# EAGLE design rgb_chronos (EAGLE 8.4.1)
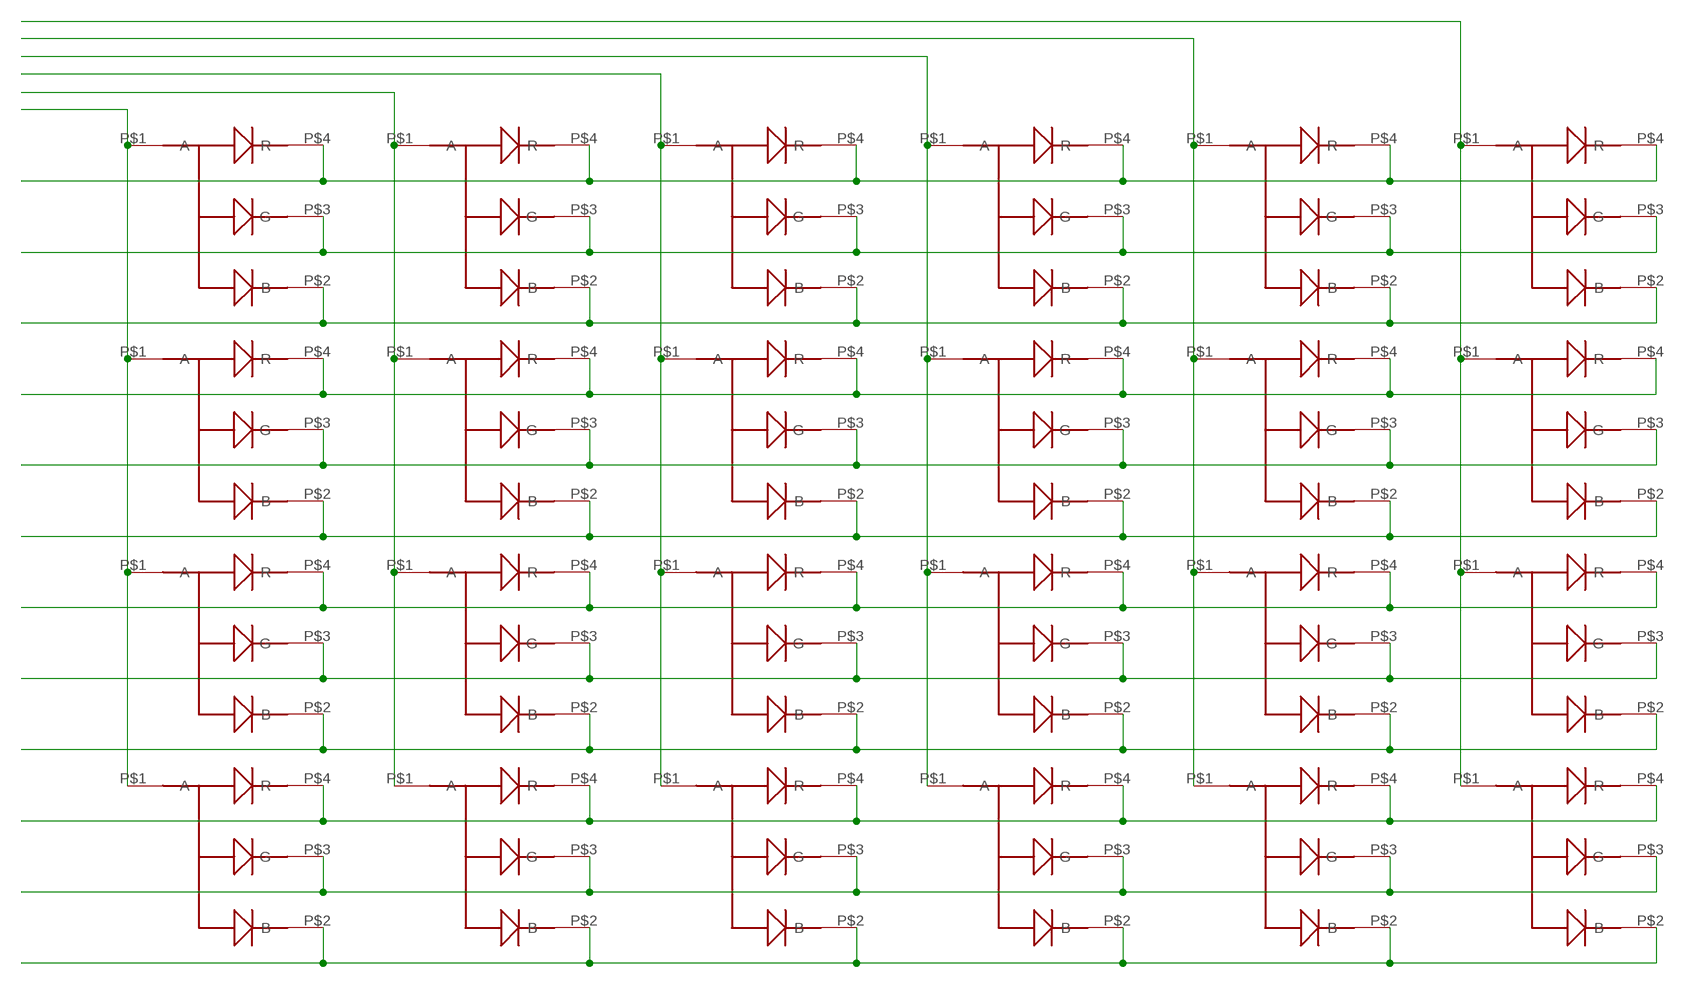
[diagram p0: schematic, sheet 1]

## Parts
U$1  ASMB-MTB0-0A3A2  LED3_ARGB  [PLCC4-LED]
U$2  ASMB-MTB0-0A3A2  LED3_ARGB  [PLCC4-LED]
U$3  ASMB-MTB0-0A3A2  LED3_ARGB  [PLCC4-LED]
U$4  ASMB-MTB0-0A3A2  LED3_ARGB  [PLCC4-LED]
U$5  ASMB-MTB0-0A3A2  LED3_ARGB  [PLCC4-LED]
U$6  ASMB-MTB0-0A3A2  LED3_ARGB  [PLCC4-LED]
U$7  ASMB-MTB0-0A3A2  LED3_ARGB  [PLCC4-LED]
U$8  ASMB-MTB0-0A3A2  LED3_ARGB  [PLCC4-LED]
U$9  ASMB-MTB0-0A3A2  LED3_ARGB  [PLCC4-LED]
U$10  ASMB-MTB0-0A3A2  LED3_ARGB  [PLCC4-LED]
U$11  ASMB-MTB0-0A3A2  LED3_ARGB  [PLCC4-LED]
U$12  ASMB-MTB0-0A3A2  LED3_ARGB  [PLCC4-LED]
U$13  ASMB-MTB0-0A3A2  LED3_ARGB  [PLCC4-LED]
U$14  ASMB-MTB0-0A3A2  LED3_ARGB  [PLCC4-LED]
U$15  ASMB-MTB0-0A3A2  LED3_ARGB  [PLCC4-LED]
U$16  ASMB-MTB0-0A3A2  LED3_ARGB  [PLCC4-LED]
U$17  ASMB-MTB0-0A3A2  LED3_ARGB  [PLCC4-LED]
U$18  ASMB-MTB0-0A3A2  LED3_ARGB  [PLCC4-LED]
U$19  ASMB-MTB0-0A3A2  LED3_ARGB  [PLCC4-LED]
U$20  ASMB-MTB0-0A3A2  LED3_ARGB  [PLCC4-LED]
U$21  ASMB-MTB0-0A3A2  LED3_ARGB  [PLCC4-LED]
U$22  ASMB-MTB0-0A3A2  LED3_ARGB  [PLCC4-LED]
U$23  ASMB-MTB0-0A3A2  LED3_ARGB  [PLCC4-LED]
U$24  ASMB-MTB0-0A3A2  LED3_ARGB  [PLCC4-LED]

## Nets
COL0: U$1.P$1(A) U$2.P$1(A) U$3.P$1(A) U$4.P$1(A)
COL1: U$5.P$1(A) U$6.P$1(A) U$7.P$1(A) U$8.P$1(A)
COL2: U$9.P$1(A) U$10.P$1(A) U$11.P$1(A) U$12.P$1(A)
COL3: U$13.P$1(A) U$14.P$1(A) U$15.P$1(A) U$16.P$1(A)
COL4: U$17.P$1(A) U$18.P$1(A) U$19.P$1(A) U$20.P$1(A)
COL5: U$21.P$1(A) U$22.P$1(A) U$23.P$1(A) U$24.P$1(A)
ROW0_B: U$1.P$2(B) U$5.P$2(B) U$9.P$2(B) U$13.P$2(B) U$17.P$2(B) U$21.P$2(B)
ROW0_G: U$1.P$3(G) U$5.P$3(G) U$9.P$3(G) U$13.P$3(G) U$17.P$3(G) U$21.P$3(G)
ROW0_R: U$1.P$4(R) U$5.P$4(R) U$9.P$4(R) U$13.P$4(R) U$17.P$4(R) U$21.P$4(R)
ROW1_B: U$2.P$2(B) U$6.P$2(B) U$10.P$2(B) U$14.P$2(B) U$18.P$2(B) U$22.P$2(B)
ROW1_G: U$2.P$3(G) U$6.P$3(G) U$10.P$3(G) U$14.P$3(G) U$18.P$3(G) U$22.P$3(G)
ROW1_R: U$2.P$4(R) U$6.P$4(R) U$10.P$4(R) U$14.P$4(R) U$18.P$4(R) U$22.P$4(R)
ROW2_B: U$3.P$2(B) U$7.P$2(B) U$11.P$2(B) U$15.P$2(B) U$19.P$2(B) U$23.P$2(B)
ROW2_G: U$3.P$3(G) U$7.P$3(G) U$11.P$3(G) U$15.P$3(G) U$19.P$3(G) U$23.P$3(G)
ROW2_R: U$3.P$4(R) U$7.P$4(R) U$11.P$4(R) U$15.P$4(R) U$19.P$4(R) U$23.P$4(R)
ROW3_B: U$4.P$2(B) U$8.P$2(B) U$12.P$2(B) U$16.P$2(B) U$20.P$2(B) U$24.P$2(B)
ROW3_G: U$4.P$3(G) U$8.P$3(G) U$12.P$3(G) U$16.P$3(G) U$20.P$3(G) U$24.P$3(G)
ROW3_R: U$4.P$4(R) U$8.P$4(R) U$12.P$4(R) U$16.P$4(R) U$20.P$4(R) U$24.P$4(R)

## Library data of the parts
U$1-U$24 = pmg-library:LED3_ARGB

## Board
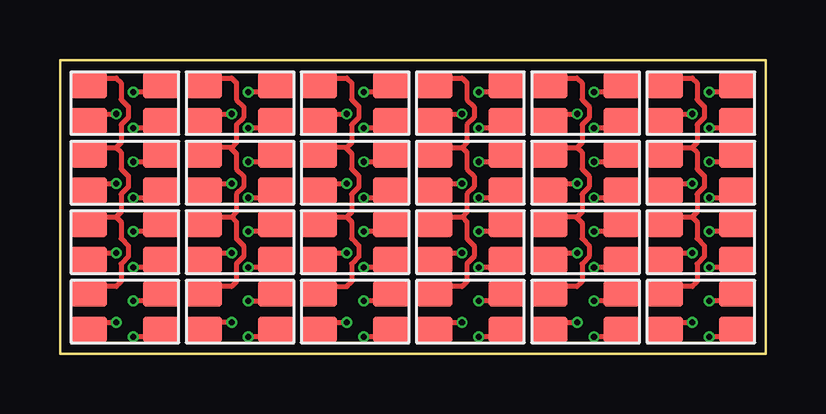
[diagram p1: board, top side]
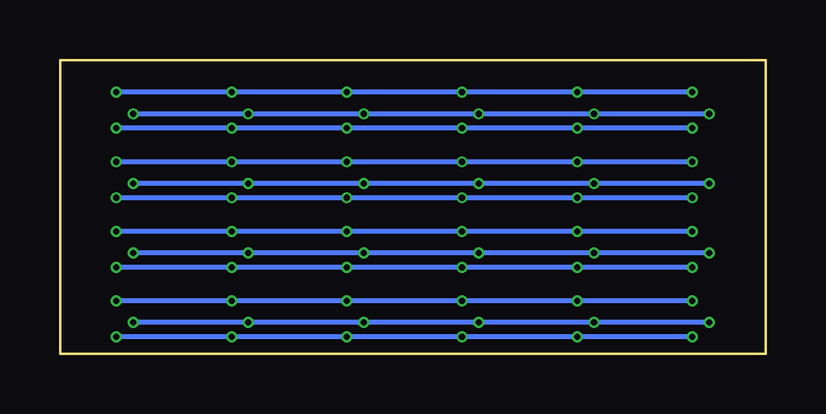
[diagram p2: board, bottom side, seen from below]

Size 29.4 x 12.25 mm. Coordinates in mm from the lower left corner, seen from the top.
Outline: 0,0 29.4,0 29.4,12.25 0,12.25 0,0
Copper layers (1*2*15*16): Top 0.035559375mm / dielectric 0.17018125mm / Route2 0.01778125mm / dielectric 47mil / Route15 0.01778125mm / dielectric 0.17018125mm / Bottom 0.035559375mm
Design rules "OSHPark-4layer *": minimum track width 5mil, minimum drill 10mil, track to track 5mil, track to pad 5mil, pad to pad 5mil, via to via 5mil, smd to smd 5mil, copper to edge 15mil, drill to drill 6mil, minimum pad ring 4mil, minimum via ring 4mil, stop-mask expansion 2.5mil, vias tented up to drill 0mil, thermal gap 10mil

### Footprints (pad centres in the part's own frame; a part is rotated, then mirrored left to right if it is on the bottom)
PLCC4-LED = smd 1.5 x 1.1: P$1 -1.5,0.75; P$2 1.5,0.75; P$3 1.5,-0.75; P$4 -1.5,-0.75

### Placement (x,y rotation side)
U$1  26.7,1.75 0 top
U$2  26.7,4.65 0 top
U$3  26.7,7.55 0 top
U$4  26.7,10.45 0 top
U$5  21.9,1.75 0 top
U$6  21.9,4.65 0 top
U$7  21.9,7.55 0 top
U$8  21.9,10.45 0 top
U$9  17.1,1.75 0 top
U$10  17.1,4.65 0 top
U$11  17.1,7.55 0 top
U$12  17.1,10.45 0 top
U$13  12.3,1.75 0 top
U$14  12.3,4.65 0 top
U$15  12.3,7.55 0 top
U$16  12.3,10.45 0 top
U$17  7.5,1.75 0 top
U$18  7.5,4.65 0 top
U$19  7.5,7.55 0 top
U$20  7.5,10.45 0 top
U$21  2.7,1.75 0 top
U$22  2.7,4.65 0 top
U$23  2.7,7.55 0 top
U$24  2.7,10.45 0 top

### Tracks (layer width: path | path; a pad name or v marks a point on that pad's centre or on a via)
COL0
  Top 0.2: U$4.P$1 25.5,11.5 26.35,11.5 26.55,11.3 26.55,10.6 26.85,10.3 26.85,9.85 26.55,9.55 26.55,8.8 26.35,8.6 | U$3.P$1 25.5,8.6 26.35,8.6 | U$2.P$1 25.5,5.7 26.35,5.7 | U$1.P$1 25.5,2.8 26.35,2.8 26.55,3 26.55,3.75 26.85,4.05 26.85,4.5 26.55,4.8 26.55,5.5 26.35,5.7 | 26.35,8.6 26.55,8.4 26.55,7.7 26.85,7.4 26.85,6.95 26.55,6.65 26.55,5.9 26.35,5.7
COL1
  Top 0.2: U$8.P$1 20.7,11.5 21.55,11.5 21.75,11.3 21.75,10.6 22.05,10.3 22.05,9.85 21.75,9.55 21.75,8.8 21.55,8.6 | U$7.P$1 20.7,8.6 21.55,8.6 | U$6.P$1 20.7,5.7 21.5,5.7 | 21.5,5.7 21.55,5.7 21.75,5.9 21.75,6.65 22.05,6.95 22.05,7.4 21.75,7.7 21.75,8.4 21.55,8.6 | U$5.P$1 20.7,2.8 21.55,2.8 21.75,3 21.75,3.75 22.05,4.05 22.05,4.5 21.75,4.8 21.75,5.45 21.5,5.7
COL2
  Top 0.2: U$12.P$1 15.9,11.5 16.75,11.5 16.95,11.3 16.95,10.6 17.25,10.3 17.25,9.85 16.95,9.55 16.95,8.8 16.75,8.6 | U$11.P$1 15.9,8.6 16.75,8.6 | U$10.P$1 15.9,5.7 16.75,5.7 | U$9.P$1 15.9,2.8 16.75,2.8 16.95,3 16.95,3.75 17.25,4.05 17.25,4.5 16.95,4.8 16.95,5.5 16.75,5.7 | 16.75,8.6 16.95,8.4 16.95,7.7 17.25,7.4 17.25,6.95 16.95,6.65 16.95,5.9 16.75,5.7
COL3
  Top 0.2: U$16.P$1 11.1,11.5 11.95,11.5 12.15,11.3 12.15,10.6 12.45,10.3 12.45,9.85 12.15,9.55 12.15,8.8 11.95,8.6 11.9,8.6 | U$15.P$1 11.1,8.6 11.9,8.6 | U$14.P$1 11.1,5.7 11.95,5.7 | U$13.P$1 11.1,2.8 11.95,2.8 12.15,3 12.15,3.75 12.45,4.05 12.45,4.5 12.15,4.8 12.15,5.5 11.95,5.7 | 11.9,8.6 12.15,8.35 12.15,7.7 12.45,7.4 12.45,6.95 12.15,6.65 12.15,5.9 11.95,5.7
COL4
  Top 0.2: U$20.P$1 6.3,11.5 7.15,11.5 7.35,11.3 7.35,10.6 7.65,10.3 7.65,9.85 7.35,9.55 7.35,8.8 7.15,8.6 7.1,8.6 | U$19.P$1 6.3,8.6 7.1,8.6 | U$18.P$1 6.3,5.7 7.15,5.7 | U$17.P$1 6.3,2.8 7.15,2.8 7.35,3 7.35,3.75 7.65,4.05 7.65,4.5 7.35,4.8 7.35,5.5 7.15,5.7 | 7.1,8.6 7.35,8.35 7.35,7.7 7.65,7.4 7.65,6.95 7.35,6.65 7.35,5.9 7.15,5.7
COL5
  Top 0.2: U$24.P$1 1.5,11.5 2.35,11.5 2.55,11.3 2.55,10.6 2.85,10.3 2.85,9.85 2.55,9.55 2.55,8.8 2.35,8.6 | U$23.P$1 1.5,8.6 2.35,8.6 | U$22.P$1 1.5,5.7 2.35,5.7 | U$21.P$1 1.5,2.8 2.35,2.8 2.55,3 2.55,3.75 2.85,4.05 2.85,4.5 2.55,4.8 2.55,5.5 2.35,5.7 | 2.35,8.6 2.55,8.4 2.55,7.7 2.85,7.4 2.85,6.95 2.55,6.65 2.55,5.9 2.35,5.7
ROW0_B  (via drill 0.25)
  Top 0.2: U$21.P$2 3.9,2.2 v3.05,2.2 | U$17.P$2 8.7,2.2 v7.85,2.2 | U$13.P$2 13.5,2.2 v12.65,2.2 | U$9.P$2 18.3,2.2 v17.45,2.2 | U$5.P$2 23.1,2.2 v22.25,2.2 | U$1.P$2 27.9,2.2 v27.05,2.2
  Bottom 0.2: v3.05,2.2 v7.85,2.2 v12.65,2.2 v17.45,2.2 v22.25,2.2 v27.05,2.2
ROW0_G  (via drill 0.25)
  Top 0.2: U$21.P$3 3.9,0.7 v3.05,0.7 | U$17.P$3 8.7,0.7 v7.85,0.7 | U$13.P$3 13.5,0.7 v12.65,0.7 | U$9.P$3 18.3,0.7 v17.45,0.7 | U$5.P$3 23.1,0.7 v22.25,0.7 | U$1.P$3 27.9,0.7 v27.05,0.7
  Bottom 0.2: v3.05,0.7 v7.85,0.7 v12.65,0.7 v17.45,0.7 v22.25,0.7 v27.05,0.7
ROW0_R  (via drill 0.25)
  Top 0.2: U$21.P$4 1.5,1.3 v2.35,1.3 | U$17.P$4 6.3,1.3 v7.15,1.3 | U$13.P$4 11.1,1.3 v11.95,1.3 | U$9.P$4 15.9,1.3 v16.75,1.3 | U$5.P$4 20.7,1.3 v21.55,1.3 | U$1.P$4 25.5,1.3 v26.35,1.3
  Bottom 0.2: v2.35,1.3 v7.15,1.3 v11.95,1.3 v16.75,1.3 v21.55,1.3 v26.35,1.3
ROW1_B  (via drill 0.25)
  Top 0.2: U$22.P$2 3.9,5.1 v3.05,5.1 | U$18.P$2 8.7,5.1 v7.85,5.1 | U$14.P$2 13.5,5.1 v12.65,5.1 | U$10.P$2 18.3,5.1 v17.45,5.1 | U$6.P$2 23.1,5.1 v22.25,5.1 | U$2.P$2 27.9,5.1 v27.05,5.1
  Bottom 0.2: v3.05,5.1 v7.85,5.1 v12.65,5.1 v17.45,5.1 v22.25,5.1 v27.05,5.1
ROW1_G  (via drill 0.25)
  Top 0.2: U$22.P$3 3.9,3.6 v3.05,3.6 | U$18.P$3 8.7,3.6 v7.85,3.6 | U$14.P$3 13.5,3.6 v12.65,3.6 | U$10.P$3 18.3,3.6 v17.45,3.6 | U$6.P$3 23.1,3.6 v22.25,3.6 | U$2.P$3 27.9,3.6 v27.05,3.6
  Bottom 0.2: v3.05,3.6 v7.85,3.6 v12.65,3.6 v17.45,3.6 v22.25,3.6 v27.05,3.6
ROW1_R  (via drill 0.25)
  Top 0.2: U$22.P$4 1.5,4.2 v2.35,4.2 | U$18.P$4 6.3,4.2 v7.15,4.2 | U$14.P$4 11.1,4.2 v11.95,4.2 | U$10.P$4 15.9,4.2 v16.75,4.2 | U$6.P$4 20.7,4.2 v21.55,4.2 | U$2.P$4 25.5,4.2 v26.35,4.2
  Bottom 0.2: v2.35,4.2 v7.15,4.2 v11.95,4.2 v16.75,4.2 v21.55,4.2 v26.35,4.2
ROW2_B  (via drill 0.25)
  Top 0.2: U$23.P$2 3.9,8 v3.05,8 | U$19.P$2 8.7,8 v7.85,8 | U$15.P$2 13.5,8 v12.65,8 | U$11.P$2 18.3,8 v17.45,8 | U$7.P$2 23.1,8 v22.25,8 | U$3.P$2 27.9,8 v27.05,8
  Bottom 0.2: v3.05,8 v7.85,8 v12.65,8 v17.45,8 v22.25,8 v27.05,8
ROW2_G  (via drill 0.25)
  Top 0.2: U$23.P$3 3.9,6.5 v3.05,6.5 | U$19.P$3 8.7,6.5 v7.85,6.5 | U$15.P$3 13.5,6.5 v12.65,6.5 | U$11.P$3 18.3,6.5 v17.45,6.5 | U$7.P$3 23.1,6.5 v22.25,6.5 | U$3.P$3 27.9,6.5 v27.05,6.5
  Bottom 0.2: v3.05,6.5 v7.85,6.5 v12.65,6.5 v17.45,6.5 v22.25,6.5 v27.05,6.5
ROW2_R  (via drill 0.25)
  Top 0.2: U$23.P$4 1.5,7.1 v2.35,7.1 | U$19.P$4 6.3,7.1 v7.15,7.1 | U$15.P$4 11.1,7.1 v11.95,7.1 | U$11.P$4 15.9,7.1 v16.75,7.1 | U$7.P$4 20.7,7.1 v21.55,7.1 | U$3.P$4 25.5,7.1 v26.35,7.1
  Bottom 0.2: v2.35,7.1 v7.15,7.1 v11.95,7.1 v16.75,7.1 v21.55,7.1 v26.35,7.1
ROW3_B  (via drill 0.25)
  Top 0.2: U$24.P$2 3.9,10.9 v3.05,10.9 | U$20.P$2 8.7,10.9 v7.85,10.9 | U$16.P$2 13.5,10.9 v12.65,10.9 | U$12.P$2 18.3,10.9 v17.45,10.9 | U$8.P$2 23.1,10.9 v22.25,10.9 | U$4.P$2 27.9,10.9 v27.05,10.9
  Bottom 0.2: v3.05,10.9 v7.85,10.9 v12.65,10.9 v17.45,10.9 v22.25,10.9 v27.05,10.9
ROW3_G  (via drill 0.25)
  Top 0.2: U$24.P$3 3.9,9.4 v3.05,9.4 | U$20.P$3 8.7,9.4 v7.85,9.4 | U$16.P$3 13.5,9.4 v12.65,9.4 | U$12.P$3 18.3,9.4 v17.45,9.4 | U$8.P$3 23.1,9.4 v22.25,9.4 | U$4.P$3 27.9,9.4 v27.05,9.4
  Bottom 0.2: v3.05,9.4 v7.85,9.4 v12.65,9.4 v17.45,9.4 v22.25,9.4 v27.05,9.4
ROW3_R  (via drill 0.25)
  Top 0.2: U$24.P$4 1.5,10 v2.35,10 | U$20.P$4 6.3,10 v7.15,10 | U$16.P$4 11.1,10 v11.95,10 | U$12.P$4 15.9,10 v16.75,10 | U$8.P$4 20.7,10 v21.55,10 | U$4.P$4 25.5,10 v26.35,10
  Bottom 0.2: v2.35,10 v7.15,10 v11.95,10 v16.75,10 v21.55,10 v26.35,10